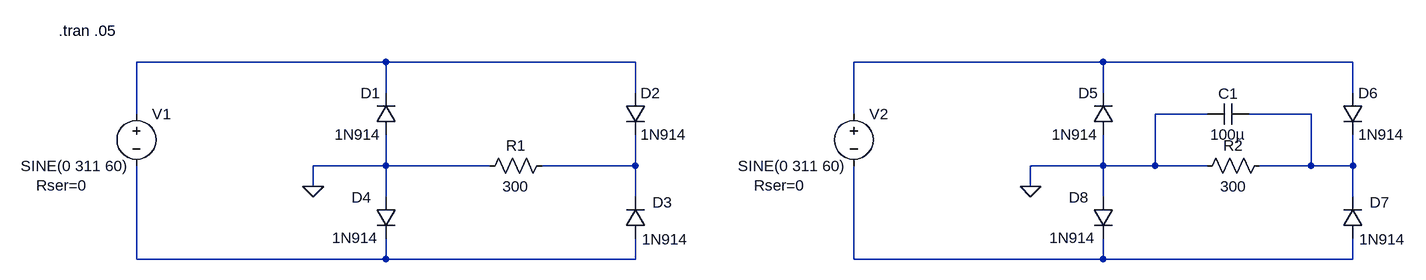
[diagram p0: schematic Diodo - RetificadorOndaCompleta_PonteCompleta.asc]
Diodo - RetificadorOndaCompleta_PonteCompleta.asc, the LTspice schematic file:
Version 4
SHEET 1 1784 680
WIRE 208 -32 -176 -32
WIRE 592 -32 208 -32
WIRE 1312 -32 928 -32
WIRE 1696 -32 1312 -32
WIRE 208 16 208 -32
WIRE 592 16 592 -32
WIRE 1312 16 1312 -32
WIRE 1696 16 1696 -32
WIRE -176 48 -176 -32
WIRE 928 48 928 -32
WIRE 1472 48 1392 48
WIRE 1632 48 1536 48
WIRE 208 128 208 80
WIRE 208 128 96 128
WIRE 368 128 208 128
WIRE 592 128 592 80
WIRE 592 128 448 128
WIRE 1312 128 1312 80
WIRE 1312 128 1200 128
WIRE 1392 128 1392 48
WIRE 1392 128 1312 128
WIRE 1472 128 1392 128
WIRE 1632 128 1632 48
WIRE 1632 128 1552 128
WIRE 1696 128 1696 80
WIRE 1696 128 1632 128
WIRE 96 160 96 128
WIRE 1200 160 1200 128
WIRE 208 176 208 128
WIRE 592 176 592 128
WIRE 1312 176 1312 128
WIRE 1696 176 1696 128
WIRE -176 272 -176 128
WIRE 208 272 208 240
WIRE 208 272 -176 272
WIRE 592 272 592 240
WIRE 592 272 208 272
WIRE 928 272 928 128
WIRE 1312 272 1312 240
WIRE 1312 272 928 272
WIRE 1696 272 1696 240
WIRE 1696 272 1312 272
FLAG 96 160 0
FLAG 1200 160 0
SYMBOL res 464 112 R90
WINDOW 0 0 56 VBottom 2
WINDOW 3 32 56 VTop 2
SYMATTR InstName R1
SYMATTR Value 300
SYMBOL diode 224 80 R180
WINDOW 0 24 64 Left 2
WINDOW 3 24 0 Left 2
SYMATTR InstName D1
SYMATTR Value 1N914
SYMBOL voltage -176 32 R0
WINDOW 3 -178 96 Left 2
WINDOW 123 0 0 Left 2
WINDOW 39 -154 126 Left 2
SYMATTR Value SINE(0 311 60)
SYMATTR SpiceLine Rser=0
SYMATTR InstName V1
SYMBOL diode 576 16 R0
SYMATTR InstName D2
SYMATTR Value 1N914
SYMBOL diode 608 240 R180
WINDOW 0 -41 56 Left 2
WINDOW 3 -65 -1 Left 2
SYMATTR InstName D3
SYMATTR Value 1N914
SYMBOL diode 192 176 R0
WINDOW 0 -37 1 Left 2
WINDOW 3 -67 63 Left 2
SYMATTR InstName D4
SYMATTR Value 1N914
SYMBOL res 1568 112 R90
WINDOW 0 0 56 VBottom 2
WINDOW 3 32 56 VTop 2
SYMATTR InstName R2
SYMATTR Value 300
SYMBOL diode 1328 80 R180
WINDOW 0 24 64 Left 2
WINDOW 3 24 0 Left 2
SYMATTR InstName D5
SYMATTR Value 1N914
SYMBOL voltage 928 32 R0
WINDOW 3 -178 96 Left 2
WINDOW 123 0 0 Left 2
WINDOW 39 -154 126 Left 2
SYMATTR Value SINE(0 311 60)
SYMATTR SpiceLine Rser=0
SYMATTR InstName V2
SYMBOL diode 1680 16 R0
SYMATTR InstName D6
SYMATTR Value 1N914
SYMBOL diode 1712 240 R180
WINDOW 0 -41 56 Left 2
WINDOW 3 -65 -1 Left 2
SYMATTR InstName D7
SYMATTR Value 1N914
SYMBOL diode 1296 176 R0
WINDOW 0 -37 1 Left 2
WINDOW 3 -67 63 Left 2
SYMATTR InstName D8
SYMATTR Value 1N914
SYMBOL cap 1536 32 R90
WINDOW 0 0 32 VBottom 2
WINDOW 3 32 32 VTop 2
SYMATTR InstName C1
SYMATTR Value 100µ
TEXT -296 -80 Left 2 !.tran .05

The netlist it stands for:
* Diodo - RetificadorOndaCompleta_PonteCompleta.asc
R1 N004 0 300
D1 0 N001 1N914
V1 N001 N005 SINE(0 311 60) Rser=0
D2 N001 N004 1N914
D3 N005 N004 1N914
D4 0 N005 1N914
R2 N003 0 300
D5 0 N002 1N914
V2 N002 N006 SINE(0 311 60) Rser=0
D6 N002 N003 1N914
D7 N006 N003 1N914
D8 0 N006 1N914
C1 N003 0 100µ
.model D D
.lib standard.dio
.tran .05
.backanno
.end